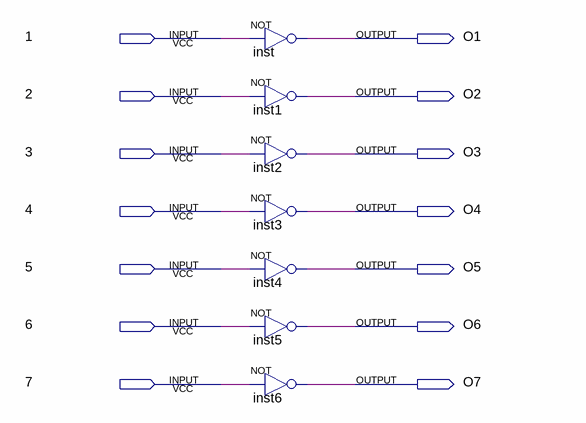
[diagram p0: schematic sheet]
// Quartus schematic Inv7.bdf as structural Verilog: 7 symbols, 14 pins
module Inv7 (
  input  \1 ,
  input  \2 ,
  input  \3 ,
  input  \4 ,
  input  \5 ,
  input  \6 ,
  input  \7 ,
  output O1,
  output O2,
  output O3,
  output O4,
  output O5,
  output O6,
  output O7
);

  not inst (O1, \1 );
  not inst1 (O2, \2 );
  not inst2 (O3, \3 );
  not inst3 (O4, \4 );
  not inst4 (O5, \5 );
  not inst5 (O6, \6 );
  not inst6 (O7, \7 );
endmodule
